# EAGLE design MegaAndLed (EAGLE 6.1)
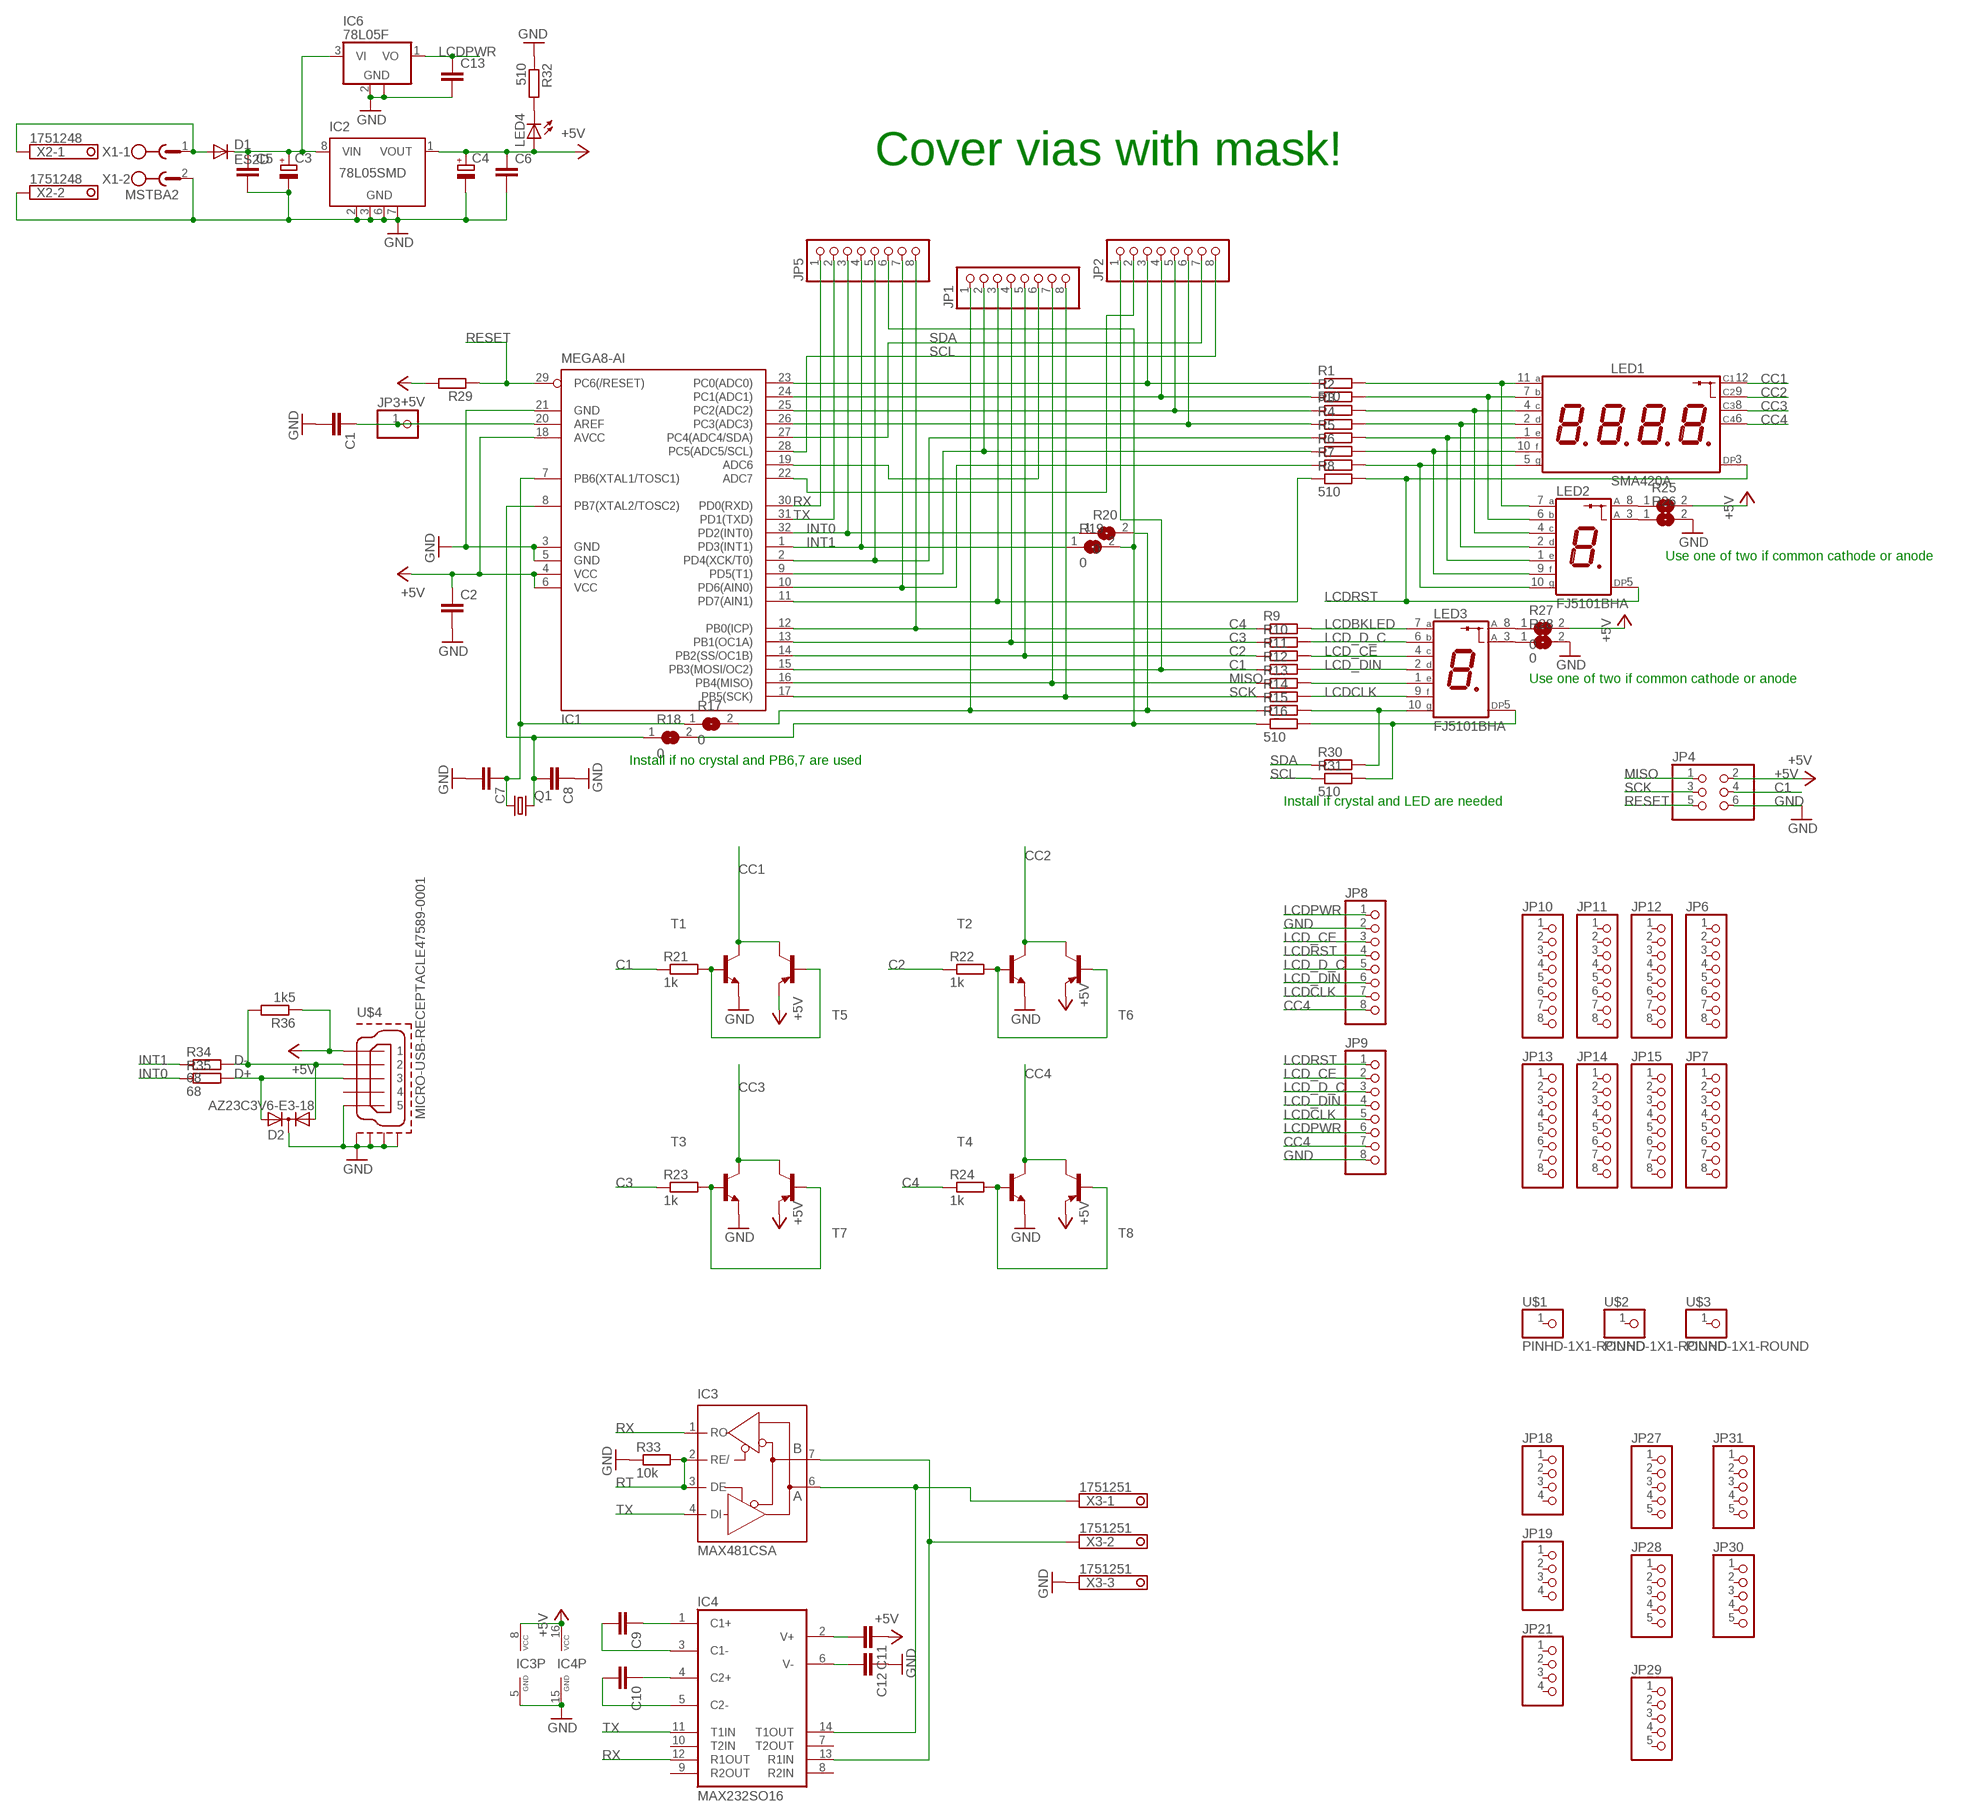
[diagram p0: schematic, sheet 1]

## Parts
C1  C-EUC0805  [C0805]
C2  C-EUC0805  [C0805]
C3  CPOL-EUSMCC  [SMC_C]
C4  CPOL-EUSMCC  [SMC_C]
C5  C-EUC0805  [C0805]
C6  C-EUC0805  [C0805]
C7  C-EUC0805  [C0805]
C8  C-EUC0805  [C0805]
C9  C-EUC0805  [C0805]
C10  C-EUC0805  [C0805]
C11  C-EUC0805  [C0805]
C12  C-EUC0805  [C0805]
C13  C-EUC0805  [C0805]
D1  ES2D  [SMB]
D2  AZ23C3V6-E3-18  DIODE-2AC|CASOT23  [SOT23]
IC1  MEGA8-AI  [TQFP32-08]
IC2  78L05SMD  [SO08]
IC3  MAX481CSA  [SO08]
IC4  MAX232SO16  [SO16]
IC6  78L05F  [SOT89]
JP1  PINHD-1X8-ROUND  [1X08-ROUND]
JP2  PINHD-1X8-ROUND  [1X08-ROUND]
JP3  PINHD-1X1  [1X01]
JP4  PINHD-2X3  [2X03]
JP5  PINHD-1X8-ROUND  [1X08-ROUND]
JP6  PINHD-1X8-ROUND  [1X08-ROUND]
JP7  PINHD-1X8-ROUND  [1X08-ROUND]
JP8  PINHD-1X8-ROUND  [1X08-ROUND]
JP9  PINHD-1X8-ROUND  [1X08-ROUND]
JP10  PINHD-1X8-ROUND  [1X08-ROUND]
JP11  PINHD-1X8-ROUND  [1X08-ROUND]
JP12  PINHD-1X8-ROUND  [1X08-ROUND]
JP13  PINHD-1X8-ROUND  [1X08-ROUND]
JP14  PINHD-1X8-ROUND  [1X08-ROUND]
JP15  PINHD-1X8-ROUND  [1X08-ROUND]
JP18  PINHD-1X4-ROUND  [1X04-ROUND]
JP19  PINHD-1X4-ROUND  [1X04-ROUND]
JP21  PINHD-1X4-ROUND  [1X04-ROUND]
JP27  PINHD-1X5-ROUND  [1X05-ROUND]
JP28  PINHD-1X5-ROUND  [1X05-ROUND]
JP29  PINHD-1X5-ROUND  [1X05-ROUND]
JP30  PINHD-1X5-ROUND  [1X05-ROUND]
JP31  PINHD-1X5-ROUND  [1X05-ROUND]
LED1  SMA420A  [7X4-LED]
LED2  FJ5101BHA  [LA-401]
LED3  FJ5101BHA  [LA-401]
LED4  LEDCHIPLED_1206  [CHIPLED_1206]
Q1  CRYSTALHC49U-H  [HC49U-H]
R1  510  R-EU_R0805  [R0805]
R2  R-EU_R0805  [R0805]
R3  R-EU_R0805  [R0805]
R4  R-EU_R0805  [R0805]
R5  R-EU_R0805  [R0805]
R6  R-EU_R0805  [R0805]
R7  R-EU_R0805  [R0805]
R8  510  R-EU_R0805  [R0805]
R9  R-EU_R0805  [R0805]
R10  R-EU_R0805  [R0805]
R11  R-EU_R0805  [R0805]
R12  R-EU_R0805  [R0805]
R13  R-EU_R0805  [R0805]
R14  R-EU_R0805  [R0805]
R15  R-EU_R0805  [R0805]
R16  510  R-EU_R0805  [R0805]
R17  0  SJ  [SJ]
R18  0  SJ  [SJ]
R19  0  SJ  [SJ]
R20  0  SJ  [SJ]
R21  1k  R-EU_R0805  [R0805]
R22  1k  R-EU_R0805  [R0805]
R23  1k  R-EU_R0805  [R0805]
R24  1k  R-EU_R0805  [R0805]
R25  SJ  [SJ]
R26  SJ  [SJ]
R27  0  SJ  [SJ]
R28  0  SJ  [SJ]
R29  R-EU_R0805  [R0805]
R30  R-EU_R0805  [R0805]
R31  510  R-EU_R0805  [R0805]
R32  510  R-EU_R0805  [R0805]
R33  10k  R-EU_R0805  [R0805]
R34  68  R-EU_R0805  [R0805]
R35  68  R-EU_R0805  [R0805]
R36  1k5  R-EU_R0805  [R0805]
T1  BCW31-NPN-SOT23-BEC  [SOT23-BEC]
T2  BCW31-NPN-SOT23-BEC  [SOT23-BEC]
T3  BCW31-NPN-SOT23-BEC  [SOT23-BEC]
T4  BCW31-NPN-SOT23-BEC  [SOT23-BEC]
T5  MMBTA56-SOT23  [SOT23]
T6  MMBTA56-SOT23  [SOT23]
T7  MMBTA56-SOT23  [SOT23]
T8  MMBTA56-SOT23  [SOT23]
U$1  PINHD-1X1-ROUND  [1X01-ROUND]
U$2  PINHD-1X1-ROUND  [1X01-ROUND]
U$3  PINHD-1X1-ROUND  [1X01-ROUND]
U$4  MICRO-USB-RECEPTACLE47589-0001  [47589-0001]
X1  MSTBA2  [MSTBA2]
X2  1751248  [1751248]
X3  1751251  [1751251]

## Nets
+5V: C2.1 C4.+ C6.1 C11.1 IC1.4(VCC) IC1.6(VCC) IC1.18(AVCC) IC2.1(VOUT) IC3.8(VCC) IC4.16(VCC) JP4.2 LED4.A R25.2 R27.2 R29.2 R36.1 T5.2(E) T6.2(E) T7.2(E) T8.2(E) U$4.1
C1: IC1.15(PB3(MOSI/OC2)) JP2.1 JP4.4 R12.1 R21.1
C2: IC1.14(PB2(SS/OC1B)) JP1.5 R11.1 R22.1
C3: IC1.13(PB1(OC1A)) JP1.4 R10.1 R23.1
C4: IC1.12(PB0(ICP)) JP5.8 R9.1 R24.1
CC1: LED1.12(C) T1.C T5.3(C)
CC2: LED1.9(C) T2.C T6.3(C)
CC3: LED1.8(C) T3.C T7.3(C)
CC4: JP8.8 JP9.7 LED1.6(C) T4.C T8.3(C)
D+: D2.2(A2) R35.2 U$4.3
D-: D2.1(A1) R34.2 R36.2 U$4.2
GND: C1.2 C2.2 C3.- C4.- C5.2 C6.2 C7.2 C8.1 C12.1 C13.2 D2.3(C) IC1.3(GND) IC1.5(GND) IC1.21(GND) IC2.2(GND) IC2.3(GND) IC2.6(GND) IC2.7(GND) IC3.5(GND) IC4.15(GND) IC6.2(GND) IC6.2@1(GND) JP4.6 JP8.2 JP9.8 R26.2 R28.2 R32.1 R33.1 T1.E T2.E T3.E T4.E U$4.5 U$4.CASING1(GND1) U$4.CASING2(GND2) U$4.CASING3(GND3) U$4.CASING4(GND4) X1.2 X2.2 X3.3
INT0: IC1.32(PD2(INT0)) JP5.3 R20.1 R35.1
INT1: IC1.1(PD3(INT1)) JP5.4 R19.1 R34.1
LCD_CE: JP8.3 JP9.2 LED3.4(C) R11.2
LCD_D_C: JP8.5 JP9.3 LED3.6(B) R10.2
LCD_DIN: JP8.6 JP9.4 LED3.2(D) R12.2
LCDBKLED: LED3.7(A) R9.2
LCDCLK: JP8.7 JP9.5 LED3.9(F) R14.2
LCDPWR: C13.1 IC6.1(VO) JP8.1 JP9.6
LCDRST: JP8.4 JP9.1 LED1.3(DP) LED2.5(DP) R8.2
MISO: IC1.16(PB4(MISO)) JP1.7 JP4.1 R13.1
N$1: C3.+ C5.1 D1.C IC2.8(VIN) IC6.3(VI)
N$2: IC1.23(PC0(ADC0)) JP2.3 R1.1
N$3: IC1.24(PC1(ADC1)) JP2.4 R2.1
N$4: IC1.25(PC2(ADC2)) JP2.5 R3.1
N$5: R21.2 T1.B T5.1(B)
N$6: R22.2 T2.B T6.1(B)
N$7: IC1.26(PC3(ADC3)) JP2.6 R4.1
N$8: C1.1 IC1.20(AREF) JP3.1
N$9: LED2.8(C) R25.1
N$10: LED2.3(C) R26.1
N$11: LED3.8(C) R27.1
N$12: LED3.3(C) R28.1
N$13: IC1.19(ADC6) JP1.6
N$14: IC1.2(PD4(XCK/T0)) JP5.5 R5.1
N$15: R23.2 T3.B T7.1(B)
N$16: R24.2 T4.B T8.1(B)
N$17: IC1.22(ADC7) JP2.2
N$19: IC1.9(PD5(T1)) JP1.2 R6.1
N$20: IC1.10(PD6(AIN0)) JP5.7 R7.1
N$22: LED4.C R32.2
N$23: C9.1 IC4.1(C1+)
N$24: D1.A X1.1 X2.1
N$25: C10.1 IC4.4(C2+)
N$29: IC1.11(PD7(AIN1)) JP1.3 R8.1
N$30: C8.2 IC1.8(PB7(XTAL2/TOSC2)) Q1.2 R18.1
N$31: C10.2 IC4.5(C2-)
N$32: C9.2 IC4.3(C1-)
N$35: C11.2 IC4.2(V+)
N$36: JP5.6 R16.1 R18.2 R19.2
N$37: LED1.11(A) LED2.7(A) R1.2
N$38: LED1.7(B) LED2.6(B) R2.2
N$39: LED1.4(C) LED2.4(C) R3.2
N$40: LED1.2(D) LED2.2(D) R4.2
N$41: LED1.1(E) LED2.1(E) R5.2
N$42: LED1.10(F) LED2.9(F) R6.2
N$43: LED1.5(G) LED2.10(G) R7.2
N$50: LED3.1(E) R13.2
N$52: LED3.10(G) R15.2 R30.2
N$53: LED3.5(DP) R16.2 R31.2
N$68: C12.2 IC4.6(V-)
N$69: JP1.1 R15.1 R17.2 R20.2
N$70: IC3.6(A) IC4.14(T1OUT) X3.1
N$71: IC3.7(B) IC4.13(R1IN) X3.2
N$72: C7.1 IC1.7(PB6(XTAL1/TOSC1)) Q1.1 R17.1
RESET: IC1.29(PC6(/RESET)) JP4.5 R29.1
RT: IC3.2(RE/) IC3.3(DE) R33.2
RX: IC1.30(PD0(RXD)) IC3.1(RO) IC4.12(R1OUT) JP5.1
SCK: IC1.17(PB5(SCK)) JP1.8 JP4.3 R14.1
SCL: IC1.28(PC5(ADC5/SCL)) JP2.8 R31.1
SDA: IC1.27(PC4(ADC4/SDA)) JP2.7 R30.1
TX: IC1.31(PD1(TXD)) IC3.4(DI) IC4.11(T1IN) JP5.2
Unconnected: IC2.4(NC) IC2.5(NC) IC4.7(T2OUT) IC4.8(R2IN) IC4.9(R2OUT) IC4.10(T2IN) JP6.1 JP6.2 JP6.3 JP6.4 JP6.5 JP6.6 JP6.7 JP6.8 JP7.1 JP7.2 JP7.3 JP7.4 JP7.5 JP7.6 JP7.7 JP7.8 JP10.1 JP10.2 JP10.3 JP10.4 JP10.5 JP10.6 JP10.7 JP10.8 JP11.1 JP11.2 JP11.3 JP11.4 JP11.5 JP11.6 JP11.7 JP11.8 JP12.1 JP12.2 JP12.3 JP12.4 JP12.5 JP12.6 JP12.7 JP12.8 JP13.1 JP13.2 JP13.3 JP13.4 JP13.5 JP13.6 JP13.7 JP13.8 JP14.1 JP14.2 JP14.3 JP14.4 JP14.5 JP14.6 JP14.7 JP14.8 JP15.1 JP15.2 JP15.3 JP15.4 JP15.5 JP15.6 JP15.7 JP15.8 JP18.1 JP18.2 JP18.3 JP18.4 JP19.1 JP19.2 JP19.3 JP19.4 JP21.1 JP21.2 JP21.3 JP21.4 JP27.1 JP27.2 JP27.3 JP27.4 JP27.5 JP28.1 JP28.2 JP28.3 JP28.4 JP28.5 JP29.1 JP29.2 JP29.3 JP29.4 JP29.5 JP30.1 JP30.2 JP30.3 JP30.4 JP30.5 JP31.1 JP31.2 JP31.3 JP31.4 JP31.5 U$1.1 U$2.1 U$3.1 U$4.4

## Notes on the sheet
- Cover vias with mask!
- Use one of two if common cathode or anode
- Use one of two if common cathode or anode
- Install if no crystal and PB6,7 are used
- Install if crystal and LED are needed

## Library data of the parts
C1 C2 C5-C13 = rcl:C-EU: CAPACITOR, European symbol
C3 C4 = rcl:CPOL-EU: POLARIZED CAPACITOR, European symbol
D1 = diode:ES2D: DIODE super fast rectifier, 2 A
D2 = diode:DIODE-2AC|CA: Dual DIODE Anode-Cathode|Cathode-Anode
IC1 = atmel:MEGA8: MICROCONTROLLER 8 Kbytes FLASH, 1 kbytes SRAM, 512 bytes EEPROM, USART, 6-channel 10 bit ADC, 2-channel 8 bit ADC Pin compatible with Atmega48, ATMega88, ATMega168 Source: avr.lbr
IC2 = linear:78L*SMD: Positive VOLTAGE REGULATOR
IC3 = maxim:MAX481CSA: RS485 TRANSEIVER
IC4 = MAX232:MAX232: RS232 TRANSEIVER
IC6 = linear:78L*: POSITOIV-VOLTAGE REGULATORS Output up to 100 mA Source: http://focus.ti.com/lit/ds/symlink/ua78l05.pdf
JP1 JP2 JP5-JP15 = Pinhead1x8round:PINHD-1X8-ROUND: PIN HEADER
JP3 = pinhead:PINHD-1X1: PIN HEADER
JP4 = pinhead:PINHD-2X3: PIN HEADER
JP18 JP19 JP21 = Pinhead1x8round:PINHD-1X4-ROUND: PIN HEADER
JP27-JP31 = Pinhead1x8round:PINHD-1X5-ROUND: PIN HEADER
LED1 = SMA420:SMA420: 4 Digit LED Numeric Display (cathode common) SMA420* China 20*51mm h
LED2 LED3 = FJ5101BH:FJ5101BH: Single Digit LED Numeric Display (anode common) FJ5101BH China 20*12.8mm
LED4 = led:LED: LED OSRAM: - CHIPLED LG R971, LG N971, LY N971, LG Q971, LY Q971, LO R971, LY R971 LH N974, LH R974 LS Q976, LO Q976, LY Q976 LO Q996 - Hyper CHIPLED LW Q18S LB Q993, LB Q99A, LB R99A - SideLED LS A670, LO A670, LY A670, LG A670, LP A670 LB A673, LV A673, LT A673, LW A673 LH A674 LY A675 LS A676, LA A676, LO A676, LY A676, LW A676 LS A679, LY A679, LG A679 - Hyper Micro SIDELED® LS Y876, LA Y876, LO Y876, LY Y876 LT Y87S - SmartLED LW L88C, LW L88S LB L89C, LB L89S, LG L890 LS L89K, LO L89K, LY L89K LS L896, LA L896, LO L896, LY L896 - TOPLED LS T670, LO T670, LY T670, LG T670, LP T670 LSG T670, LSP T670, LSY T670, LOP T670, LYG T670 LG T671, LOG T671, LSG T671 LB T673, LV T673, LT T673, LW T673 LH T674 LS T676, LA T676, LO T676, LY T676, LB T676, LH T676, LSB T676, LW T676 LB T67C, LV T67C, LT T67C, LS T67K, LO T67K, LY T67K, LW E67C LS E67B, LA E67B, LO E67B, LY E67B, LB E67C, LV E67C, LT E67C LW T67C LS T679, LY T679, LG T679 LS T770, LO T770, LY T770, LG T770, LP T770 LB T773, LV T773, LT T773, LW T773 LH T774 LS E675, LA E675, LY E675, LS T675 LS T776, LA T776, LO T776, LY T776, LB T776 LHGB T686 LT T68C, LB T68C - Hyper Mini TOPLED® LB M676 - Mini TOPLED Santana® LG M470 LS M47K, LO M47K, LY M47K Source: http://www.osram.convergy.de LUXEON: - LUMILED® LXK2-PW12-R00, LXK2-PW12-S00, LXK2-PW14-U00, LXK2-PW14-V00 LXK2-PM12-R00, LXK2-PM12-S00, LXK2-PM14-U00 LXK2-PE12-Q00, LXK2-PE12-R00, LXK2-PE12-S00, LXK2-PE14-T00, LXK2-PE14-U00 LXK2-PB12-K00, LXK2-PB12-L00, LXK2-PB12-M00, LXK2-PB14-N00, LXK2-PB14-P00, LXK2-PB14-Q00 LXK2-PR12-L00, LXK2-PR12-M00, LXK2-PR14-Q00, LXK2-PR14-R00 LXK2-PD12-Q00, LXK2-PD12-R00, LXK2-PD12-S00 LXK2-PH12-R00, LXK2-PH12-S00 LXK2-PL12-P00, LXK2-PL12-Q00, LXK2-PL12-R00 Source: www.luxeon.com KINGBRIGHT: KA-3528ASYC Source: www.kingbright.com
Q1 = crystal:CRYSTAL: CRYSTAL
R1-R16 R21-R24 R29-R36 = rcl:R-EU_: RESISTOR, European symbol
R17-R20 R25-R28 = jumper:SJ: SMD solder JUMPER
T1-T4 = transistor:*-NPN-: NPN Transistror
T5-T8 = transistor-pnp:*-?: PNP Transistor
U$1-U$3 = Pinhead1x8round:PINHD-1X1-ROUND
U$4 = con-molex-usb:MICRO-USB-RECEPTACLE: MICRO USB RECEPTACLES Micro-USB Receptacles, SMT, Lead-Free from MOLEX <http://www.molex.com/>. (C) 2014 Tomasz Boleslaw CEDRO, cederom@tlen.pl, http://www.tomek.cedro.info. Version 0.1 (2014-01-17): Initial release. Version 0.2 (2014-02-06): Updated 47589-0001 footprint pins/pads/milling. Following devices are included: 1. 47589-0001 Micro-USB AB Receptacle, Bottom Mount, SMT, Lead-Free <http://www.molex.com/molex/products/datasheet.jsp?part=active/0475890001_IO_CONNECTORS.xml> (Technical Drawing <http://www.molex.com/pdm_docs/sd/475890001_sd.pdf>).
X1 = con-phoenix-508:MSTBA2: PHOENIX
X2 = con-phoenix-350:1751248: MKDS 1/ 2-3,5 Printklemme Nennstrom: 10 A Bemessungsspannung: 160 V Raster: 3,5 mm Polzahl: 2 Montageart: Löten Anschlussart: Schraubanschluss Anschlussrichtung vom Leiter zur Platine: 0° Source: http://eshop.phoenixcontact.com .. 1751248.pdf
X3 = con-phoenix-350:1751251: MKDS 1/ 3-3,5 Printklemme Nennstrom: 10 A Bemessungsspannung: 160 V Raster: 3,5 mm Polzahl: 3 Montageart: Löten Anschlussart: Schraubanschluss Anschlussrichtung vom Leiter zur Platine: 0° Source: http://eshop.phoenixcontact.com .. 1751251.pdf

## Board
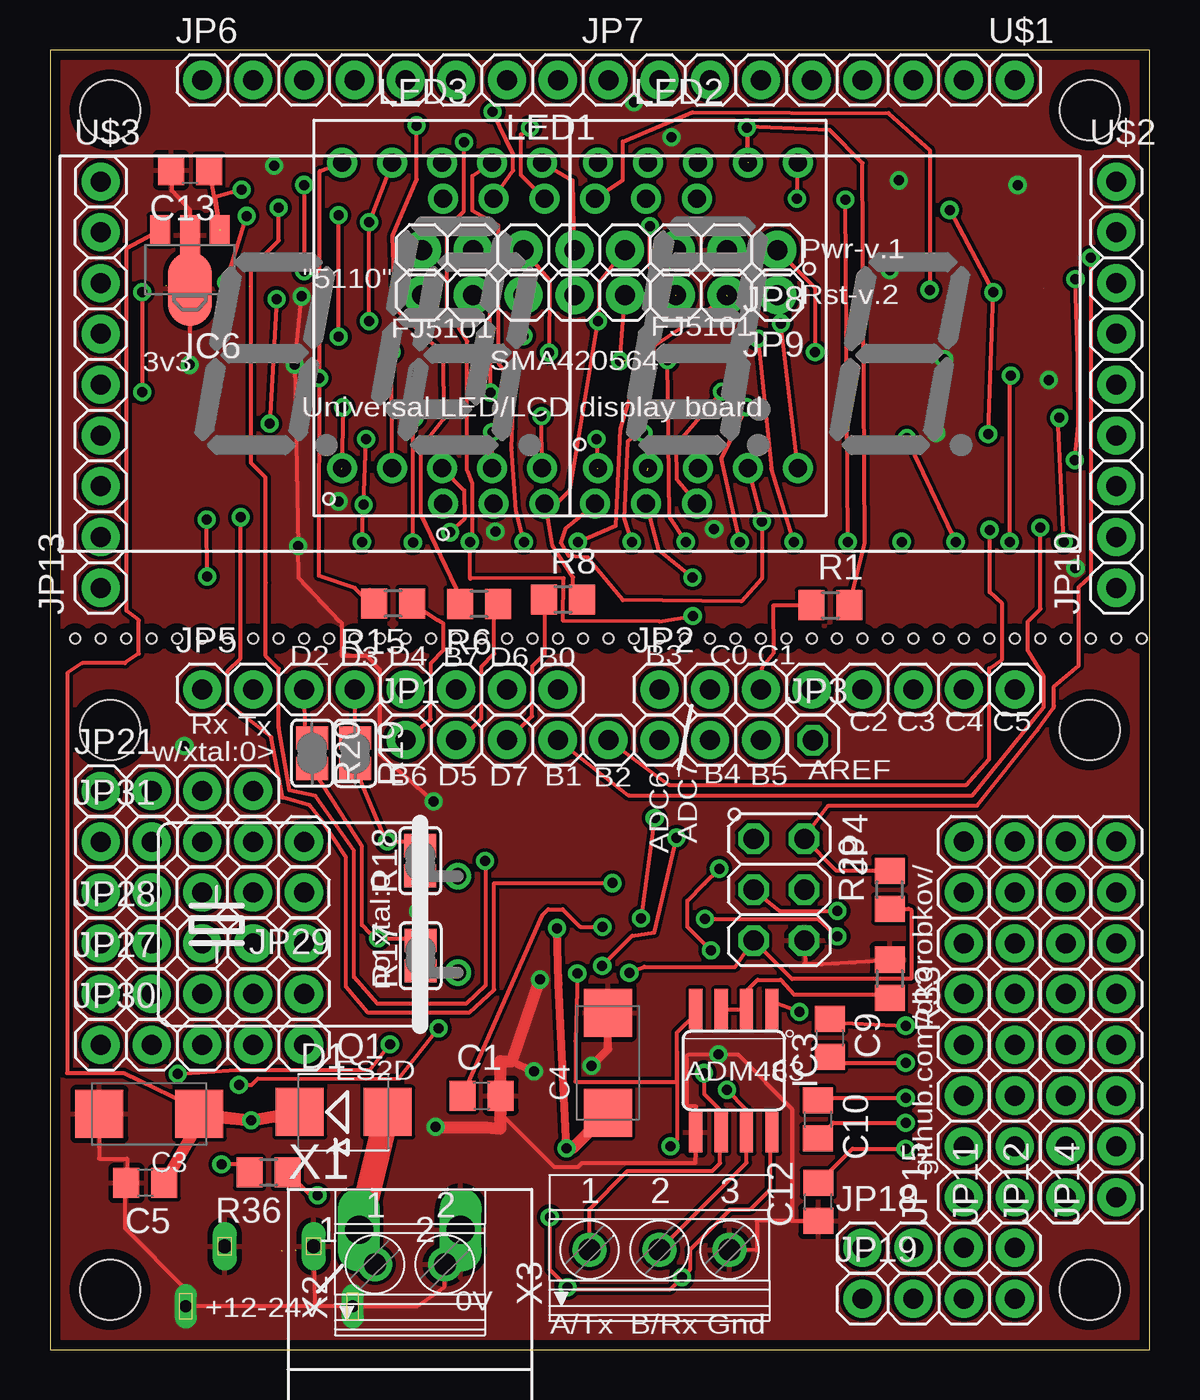
[diagram p1: board, top side]
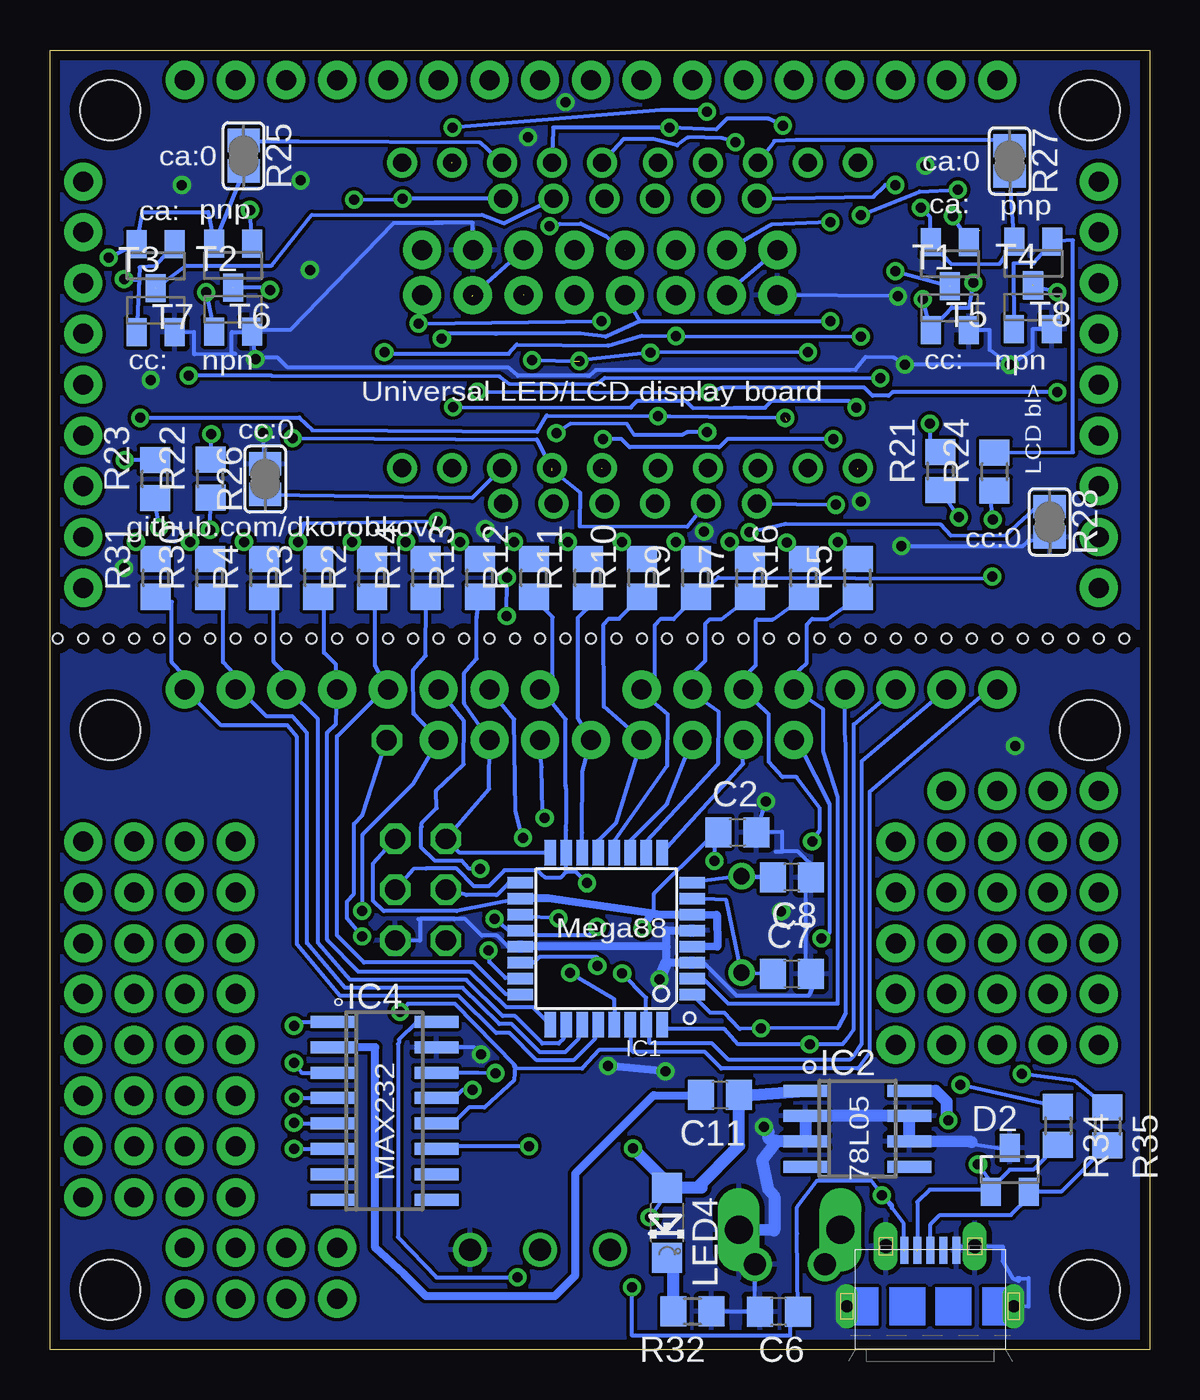
[diagram p2: board, bottom side, seen from below]

Size 55 x 65 mm. Coordinates in mm from the lower left corner, seen from the top.
Outline: 0,0 55,0 55,65 0,65 0,0
Copper layers (1*16): Top 0.0356mm / dielectric 1.5011mm / Bottom 0.0356mm
Design rules: minimum track width 7mil, minimum drill 0.5mm, track to track 7mil, track to pad 7mil, pad to pad 7mil, via to via 7mil, smd to smd 7mil, copper to edge 0.5004mm, drill to drill 0.2489mm, minimum pad ring 10mil, minimum via ring 8mil, stop-mask expansion 4mil, vias tented up to drill 0.5994mm, thermal gap 10mil
Holes 3 mm at 3,3 52,3 52,62 3,62 52,31 3,31
Holes 0.5 mm at 1.27,35.56 2.54,35.56 3.81,35.56 5.08,35.56 6.35,35.56 7.62,35.56 8.89,35.56 10.16,35.56 11.43,35.56 12.7,35.56 13.97,35.56 15.24,35.56 16.51,35.56 17.78,35.56 19.05,35.56 20.32,35.56 21.59,35.56 22.86,35.56 24.13,35.56 25.4,35.56 26.67,35.56 27.94,35.56 29.21,35.56 30.48,35.56 31.75,35.56 33.02,35.56 34.29,35.56 35.56,35.56 36.83,35.56 38.1,35.56 39.37,35.56 40.64,35.56 41.91,35.56 43.18,35.56 44.45,35.56 45.72,35.56 46.99,35.56 48.26,35.56 49.53,35.56 50.8,35.56 52.07,35.56 53.34,35.56 54.61,35.56

### Footprints (pad centres in the part's own frame; a part is rotated, then mirrored left to right if it is on the bottom)
C0805 = smd 1.3 x 1.5: 1 -0.95,0; 2 0.95,0
SMC_C = smd 2.4 x 2.4: + -2.5,0; - 2.5,0
SMB = smd 2.4 x 2.4: A 2.2,0; C -2.2,0
SOT23 = smd 1 x 1.4: 1 -0.95,-1.1; 2 0.95,-1.1; 3 0,1.1
TQFP32-08 = smd 1.27 x 0.559: 1 -4.293,2.8; 2 -4.293,2; 3 -4.293,1.2; 4 -4.293,0.4; 5 -4.293,-0.4; 6 -4.293,-1.2; 7 -4.293,-2; 8 -4.293,-2.8; 17 4.293,-2.8; 18 4.293,-2; 19 4.293,-1.2; 20 4.293,-0.4; 21 4.293,0.4; 22 4.293,1.2; 23 4.293,2; 24 4.293,2.8 | smd 0.559 x 1.27: 9 -2.8,-4.293; 10 -2,-4.293; 11 -1.2,-4.293; 12 -0.4,-4.293; 13 0.4,-4.293; 14 1.2,-4.293; 15 2,-4.293; 16 2.8,-4.293; 25 2.8,4.293; 26 2,4.293; 27 1.2,4.293; 28 0.4,4.293; 29 -0.4,4.293; 30 -1.2,4.293; 31 -2,4.293; 32 -2.8,4.293
SO08 = smd 0.6 x 2.2: 1 -1.905,-2.6; 2 -0.635,-2.6; 3 0.635,-2.6; 4 1.905,-2.6; 5 1.905,2.6; 6 0.635,2.6; 7 -0.635,2.6; 8 -1.905,2.6
SO08' = smd 0.66 x 2.032: 1 -1.905,-3.073; 2 -0.635,-3.073; 3 0.635,-3.073; 4 1.905,-3.073; 5 1.905,3.073; 6 0.635,3.073; 7 -0.635,3.073; 8 -1.905,3.073
SO16 = smd 0.6 x 2.2: 1 -4.445,-2.6; 2 -3.175,-2.6; 3 -1.905,-2.6; 4 -0.635,-2.6; 5 0.635,-2.6; 6 1.905,-2.6; 7 3.175,-2.6; 8 4.445,-2.6; 9 4.445,2.6; 10 3.175,2.6; 11 1.905,2.6; 12 0.635,2.6; 13 -0.635,2.6; 14 -1.905,2.6; 15 -3.175,2.6; 16 -4.445,2.6
SOT89 = smd 1 x 1.5: 1 -1.499,-1.981; 3 1.499,-1.981 | smd 1 x 2: 2 0,-1.727 | smd 2.2 x 3.7: 2@1 0,0.94
1X08-ROUND = drill 1 pad 1.905: 1 -8.89,0; 2 -6.35,0; 3 -3.81,0; 4 -1.27,0; 5 1.27,0; 6 3.81,0; 7 6.35,0; 8 8.89,0
1X01 = drill 1.016 octagon: 1 0,0
2X03 = drill 1.016 octagon: 1 -2.54,-1.27; 2 -2.54,1.27; 3 0,-1.27; 4 0,1.27; 5 2.54,-1.27; 6 2.54,1.27
1X04-ROUND = drill 1 pad 1.905: 1 -3.81,0; 2 -1.27,0; 3 1.27,0; 4 3.81,0
1X05-ROUND = drill 1 pad 1.905: 1 -5.08,0; 2 -2.54,0; 3 0,0; 4 2.54,0; 5 5.08,0
7X4-LED = drill 0.9 pad 1.5: 1 -6.35,-7.5; 2 -3.81,-7.5; 3 -1.27,-7.5; 4 1.27,-7.5; 5 3.81,-7.5; 6 6.35,-7.49; 7 6.35,7.75; 8 3.81,7.75; 9 1.27,7.75; 10 -1.27,7.75; 11 -3.81,7.75; 12 -6.35,7.75
LA-401 = drill 0.9 pad 1.5: 1 -5,-7.5; 2 -2.5,-7.5; 3 0,-7.5; 4 2.5,-7.5; 5 5,-7.5; 6 5,7.75; 7 2.5,7.75; 8 0,7.75; 9 -2.5,7.75; 10 -5,7.75
CHIPLED_1206 = smd 1.5 x 1.5: A 0,-1.75; C 0,1.75
HC49U-H = drill 0.813: 1 -2.413,-5.08; 2 2.413,-5.08
R0805 = smd 1.3 x 1.5: 1 -0.95,0; 2 0.95,0
SJ = smd 1.168 x 1.6: 1 -0.762,0; 2 0.762,0
SOT23-BEC = smd 1 x 1.4: B -0.95,-1.1; C 0,1.1; E 0.95,-1.1
1X01-ROUND = drill 1 pad 1.905: 1 0,0
47589-0001 = smd 1.35 x 0.4: 1 2.8,1.3; 2 2.8,0.65; 3 2.8,0; 4 2.8,-0.65; 5 2.8,-1.3 | drill 0.6 pad 0.95 long: CASING1 0,4.175; CASING2 0,-4.175 | drill 0.7 pad 1.1 long: CASING3 3,2.225; CASING4 3,-2.225
MSTBA2 = drill 1.397 long: 1 -2.54,5.08; 2 2.54,5.08
1751248 = drill 1.1 pad 1.7: 1 -1.75,-0.1; 2 1.75,-0.1
1751251 = drill 1.1 pad 1.7: 1 -3.5,-0.1; 2 0,-0.1; 3 3.5,-0.1

### Placement (x,y rotation side)
C1  21.59,12.7 0 top
C2  20.62,25.88 0 bottom
C3  4.97,11.79 180 top
C4  27.91,14.35 90 top
C5  4.77,8.34 180 top
C6  18.55,1.9 180 bottom
C7  17.9,18.8 0 bottom
C8  17.9,23.62 180 bottom
C9  39,15.59 270 top
C10  38.4,11.51 270 top
C11  21.48,12.73 180 bottom
C12  38.43,7.39 90 top
C13  7,59 180 top
D1  14.69,11.88 0 top
D2  7,9 0 bottom
IC1  27.18,20.55 180 bottom
IC2  14.61,11.04 270 bottom
IC3  MAX481CSA  [SO08']  34.21,13.95 180 top
IC4  38.27,11.95 270 bottom
IC6  7,54 180 top
JP1  26.67,30.48 0 top
JP2  39.37,33.02 0 top
JP3  38.16,30.47 0 top
JP4  36.47,23 270 top
JP5  16.51,33.02 0 top
JP6  16.51,63.5 0 top
JP7  36.83,63.5 0 top
JP8  27.5,55 180 top
JP9  27.5,52.74 180 top
JP10  53.34,46.99 90 top
JP11  48.26,16.51 90 top
JP12  50.8,16.51 90 top
JP13  2.54,46.99 90 top
JP14  53.34,16.51 90 top
JP15  45.72,16.51 90 top
JP18  44.45,5.08 0 top
JP19  44.45,2.54 0 top
JP21  6.35,27.94 0 top
JP27  7.62,17.78 0 top
JP28  7.62,20.32 0 top
JP29  7.62,22.86 180 top
JP30  7.62,15.24 0 top
JP31  7.62,25.4 0 top
LED1  26,49.81 0 top
LED2  32.4,51.6 0 top
LED3  19.6,51.6 0 top
LED4  24.13,6.35 180 bottom
Q1  15.33,21.27 90 top
R1  39.03,37.23 0 top
R2  38.9,38.6 90 bottom
R3  41.6,38.6 90 bottom
R4  44.3,38.6 90 bottom
R5  14.6,38.6 90 bottom
R6  21.45,37.29 180 top
R7  20,38.6 90 bottom
R8  25.67,37.52 0 top
R9  22.7,38.6 90 bottom
R10  25.4,38.6 90 bottom
R11  28.1,38.6 90 bottom
R12  30.8,38.6 90 bottom
R13  33.5,38.6 90 bottom
R14  36.2,38.6 90 bottom
R15  17.15,37.31 180 top
R16  17.3,38.6 90 bottom
R17  18.54,19.7 90 top
R18  18.52,24.45 90 top
R19  15.26,29.82 270 top
R20  13.11,29.83 270 top
R21  10.45,43.93 90 bottom
R22  46.97,43.55 90 bottom
R23  49.75,43.55 90 bottom
R24  7.75,43.92 90 bottom
R25  45.32,59.71 270 bottom
R26  44.23,43.53 90 bottom
R27  7,59.45 270 bottom
R28  5,41.4 270 bottom
R29  42,23 90 top
R30  47,38.6 90 bottom
R31  49.7,38.6 90 bottom
R32  22.86,1.91 180 bottom
R33  42,18.55 270 top
R34  4.58,11.18 270 bottom
R35  2.11,11.16 270 bottom
R36  10.94,8.86 180 top
T1  10,52.1 0 bottom
T2  45.84,52.01 0 bottom
T3  49.71,51.98 0 bottom
T4  5.83,52.14 0 bottom
T5  9.99,54.29 180 bottom
T6  45.85,54.22 180 bottom
T7  49.71,54.19 180 bottom
T8  5.81,54.32 180 bottom
U$1  48.26,63.5 0 top
U$2  53.34,58.42 0 top
U$3  2.54,58.42 0 top
U$4  10.97,2.16 90 bottom
X1  18,0.91 0 top
X2  18,4.37 0 top
X3  30.48,5.08 0 top

### Tracks (layer width: path | path; a pad name or v marks a point on that pad's centre or on a via)
+5V  (via drill 0.5)  (1 unrouted)
  Top 0.2: v21.77,24.43 21.79,24.39 21.79,18.22 20.8,17.3 16.38,17.3 15.2,18.63 15.2,24.96 13.28,27.7 11.98,27.97 11.44,31.13 11.44,34.04 10.79,34.68 10.79,38.34 10.78,38.36 10.78,43.62 10.05,44.35 10.05,54.08 11.45,55.48 v11.45,57.11 | R29.2 39.34,23.95 JP4.2 37.75,25.75 38,26 | 38,26 38,25.8 JP4.2 | 38,26 38.95,27.2 46.38,27.2 49.4,31.01 50.21,32.11 50.22,32.21 50.21,33.17 51.46,34.2 51.46,38.13 52.05,38.68 v52.06,54.61 | IC3.8 36,10.76 36,8 35,7 34,7 32,5 32,4 31.5,3.5 v31.6,3.6 31,3 26,3 | 26,3 v25.88,3.12 | v25.88,3.12 25,4 v25,6.62 | v25.88,3.12 26,3.12 26,3 | R36.1 13.04,7.71 v13.38,7.71
  Top 0.406: v25.36,21.07 25.45,18.3 v25.83,10.07
  Top 0.61: v25.83,10.07 26.13,10.07 C4.+
  Bottom 0.2: IC1.18 34.64,21.93 38.31,21.93 38.84,22.45 38.84,24.31 JP4.2 | 24.78,21.79 24.78,22.8 22.17,25.41 22.03,25.41 C2.1 21.77,25.67 v21.77,24.43 | T5.2 10.8,55.24 | 10.8,55.24 9.92,54.29 7.5,54.3 T8.2 R27.2 | R25.2 T6.2 47.08,56.89 50.35,56.89 T7.2 v52.06,54.61 | v11.45,57.11 11,56.66 11,55 10.8,55.2 10.8,55.24 | v25,6.62 24,8 24,8.1 | IC4.16 35.71,16.35 36.69,16.35 37.54,15.5 37.54,15.33 37.59,15.28 37.59,5.62 35.67,3.6 v31.6,3.6 | v25.88,3.12 25.88,0.7 17.98,0.7 17.98,1.9 C6.1 17.64,5.8 17.64,7.12 16.61,8.45 13.95,8.45 v13.38,7.71 | v13.38,7.71 12.9,7.08 | 12.9,7.08 12.3,6.3 12.3,4.94 | v13.38,7.71 12.9,7.23 12.9,7.08
  Bottom 0.406: IC1.18 30.07,22.57 24.89,21.8 | 24.89,21.8 24.78,21.79 24.66,21.77 IC1.6 21.64,21.75 21.62,20.14 IC1.4 | v25.36,21.07 24.89,21.8
  Bottom 0.61: 22.39,8.1 22.62,8.1 | 22.62,8.1 24,8.1 LED4.A 24.13,8.37 v25.83,10.07 | IC2.1 20.5,12.7 C11.1 20.53,10.19 22.62,8.1
C1  (via drill 0.5)
  Top 0.2: v28.13,23.33 22.22,23.33 22.22,17.99 20.99,16.87 15.88,16.87 14.8,18.14 14.8,24.62 13.57,26.5 13,27.21 11.63,27.61 11.06,30.63 8.89,32.3 8.89,33.94 9.53,34.57 9.53,37.54 v9.54,41.63
  Bottom 0.2: 29.18,23.88 IC1.15 29.18,25.99 29.17,26.54 29.17,27.98 29.21,28.23 29.21,31.51 30.46,33.05 JP2.1 29.86,33.68 29.86,36.63 30.41,37.18 R12.1 | 29.18,23.88 29.46,23.59 30.21,23.59 30.63,23.97 32.26,23.97 33.06,23.18 33.8,23.18 34.66,24.06 36.2,24.06 36.82,24.03 JP4.4 | v28.13,23.33 28.68,23.88 29.18,23.88 | v9.54,41.63 R21.1
C2  (via drill 0.5)
  Top 0.2: JP1.5 30.97,28.24 45.83,28.24 46.98,29.54 46.98,34.07 47.63,34.52 47.63,37.31 47,37.89 v47,41
  Bottom 0.2: IC1.14 28.38,25.84 28.38,28.9 28.12,29.83 JP1.5 28.59,31.57 28.59,36.61 27.8,37.4 R11.1 | v47,41 R22.1
C3  (via drill 0.5)
  Top 0.2: JP1.4 28.95,27.72 46.14,27.72 49.7,32.13 49.7,33.67 48.91,34.97 48.91,36.4 49.55,37.04 v49.53,41.12
  Bottom 0.178: 25.4,38.1 R10.1
  Bottom 0.2: IC1.13 27.59,25.44 26.67,26.36 JP1.4 27.29,32.16 27.3,36.27 27.04,36.55 26.54,36.55 25.44,37.65 R10.1 | v49.53,41.12 49.75,42.55 49.75,42.56 50,43 R23.1
C4  (via drill 0.5)
  Top 0.2: v7.86,38.66 v7.84,41.51
  Bottom 0.2: IC1.12 26.79,25.43 24.13,29.2 24.11,31.78 25.38,32.85 JP5.8 24.75,33.61 24.75,36.22 24.47,36.54 23.8,36.54 22.8,37.54 R9.1 22.7,37.72 21.56,38.62 7.86,38.56 v7.86,38.66 | v7.84,41.51 8,43 R24.1
CC1  (via drill 0.5)  (1 unrouted)
  Top 0.2: v12.71,58.25 v12.71,53.93
  Bottom 0.2: LED1.12 13.81,57.66 13.22,58.25 v12.71,58.25 | v12.71,53.93 T5.3
CC2  (via drill 0.5)  (1 unrouted)
  Top 0.2: LED1.9 28.65,58.49 28.65,60.41 32.14,61.89 41.94,61.84 44,60 v44,53
  Bottom 0.2: v44,53 44.12,53.12 T2.C
CC3  (1 unrouted)
  Bottom 0.2: T3.C 48.22,54.22 43.9,54.22 41.91,56.74 33.39,56.75 32.28,56.34 LED1.8
CC4  (via drill 0.5)  (1 unrouted)
  Top 0.2: v4.61,52.89 v4.61,47.89 | v22.03,47.86 22,52 JP9.7 | LED1.6 31.36,43.51 31.34,45.25 v33.61,47.91
  Bottom 0.2: T8.3 v4.61,52.89 | v4.61,47.89 12.86,47.89 13.04,47.7 13.85,47.7 14.26,48.11 21.35,48.11 v22.03,47.86 v33.61,47.91 | JP8.8 21,53 JP9.7
D+
  Bottom 0.2: U$4.3 10.96,4.98 10.96,6.26 10.47,6.74 6.93,6.74 6.05,7.62 D2.2 4.42,7.9 R35.2
D-  (via drill 0.5)  (1 unrouted)
  Top 0.2: R36.2 9.59,9.25 v8.58,9.26
  Bottom 0.2: 7.66,7.98 8.05,8 D2.1 7.95,7.95 8,8 7,9 5.81,9 R34.2 | 7.66,7.98 11,8 11.62,7.38 11.62,4.92 | v8.58,9.26 7.66,7.98
GND  (via drill 0.5)
  Top 0.2: JP4.6 37.78,19.32 37.73,19.3 38.66,19.3 R33.1 | X3.3 35.35,4.96 35.35,6.44 35.44,6.44 37.11,6.43 | 37.11,6.43 C12.1 | 37.11,6.43 37.11,12.03 34.42,14.76 v33.44,14.76 31.94,14.76 31.86,14.68 31.86,12.16 32.32,12.16 32.32,11.66 32.17,11.71 32.15,11.03 IC3.5 32.3,9.8 32.29,9.46 32.29,9.34 26.61,9.34 26.41,9.13 25.23,9.13 22.54,11.82 | v19.19,27.41 16.51,29.75 16.5,31.77 16.51,34 15.84,34.7 15.04,34.7 14.61,34.7 14.61,36.32 14.51,36.41 14.49,36.41 12.43,38.59 v12.41,40.18 v12.25,49.27 v12.6,52.68 | v6.98,49.25 IC6.2@1 IC6.2 7,57 6.08,57.98 6.08,59 C13.2 | v44.33,45.83 v44.72,49.53 | C3.- 2.45,10.14 2.45,9.54 3.86,9.54 3.83,8.19 | U$4.CASING3 13.25,2.2 15.22,2.19 | 15.22,2.19 15,2 | 15.22,2.19 15.19,2.16 U$4.CASING2 6.8,3.02 3.74,6.08 3.74,8.1 3.83,8.19 | 15.22,2.19 15.24,2.17 18.36,2.17 19.73,3.15 19.73,3.56 19.75,3.56 X2.2 | 3.83,8.19 3.82,8.2 C5.2
  Top 0.406: C4.- 27.09,16.02 27.92,16.02 27.92,15.02 v27.09,14.19 | v24.2,13.91 24.18,13.91 23.12,14.41
  Top 0.61: v19.28,11.14 19.32,11.11 21.83,11.11 22.54,11.05 22.54,11.82 C1.2 22.53,13.54 22.53,14.41 23.12,14.41 v24.5,18.5
  Bottom 0.2: 36.5,21.53 34.78,21.53 34.23,21.53 33.41,20.71 32.65,20.71 32.09,20.15 IC1.21 | 36.57,21.53 36.5,21.53 | 36.5,21.53 36.5,20.45 JP4.6 | IC1.3 22.29,19.34 20.65,17.71 17.04,17.71 | 17.04,17.71 | 17.04,17.71 16.5,18.78 C7.2 17.2,19.12 17.2,23.11 16.55,23.38 C8.1 16.55,23.88 17.58,24.9 18.36,24.9 | v33.44,14.76 33.8,15.12 IC4.15 | 18.69,24.9 18.36,24.9 | 18.36,24.9 18.36,25.9 C2.2 v19.19,27.41 | v12.41,40.18 6.34,40.18 6.07,40.45 R28.2 | v6.98,49.25 8,50 8,51 T1.E | T4.E 5.86,51.04 5.86,49.97 v6.98,49.25 | v6.98,49.25 v12.25,49.27 12.27,49.28 12.81,49.64 14.19,49.65 14.7,49.01 15,49 27.69,48.99 28.02,48.71 28.11,48.7 28.05,48.7 31.59,48.7 32.05,49.1 43.1,49.11 43.61,49.61 44.74,49.61 | v12.6,52.68 JP9.8 | T3.E 47.81,50.91 47.81,49.8 47.73,49.8 45.73,49.81 45.9,49.81 45.9,50.9 44.76,50.9 T2.E | R26.2 v44.33,45.83 | v44.72,49.53 T2.E | JP8.2 33.86,56.07 33.86,56.35 35.79,56.35 35.38,56.35 37.8,56.35 42.99,51 45,51 44.91,50.91 T2.E | R32.1 21.91,1.9 C6.2 19.75,1.9 X2.2 | U$4.5 9.47,5.16 U$4.CASING4 7.34,5.16 7.34,4.42 6.85,3.57 6.54,3.43 6.54,3.41 6.58,3.5 6.6,3.57 6.49,3.57 6.49,3.54 6.05,3.57 6.05,2.15 U$4.CASING2 | D2.3 7.1,10 9.07,10.29 9,10.25 8.91,10.38
  Bottom 0.406: IC1.5 24.16,20.97 24.16,20.16 | 24.16,20.16 24.16,19.35 IC1.3 | 24.16,20.16 IC1.21 | v27.09,14.19 27.08,14.2 v24.2,13.91
  Bottom 0.61: 8.91,10.38 IC2.6 IC2.7 IC2.2 IC2.3 18.64,10.42 | 18.64,10.42 19.38,9.46 19.08,8.03 18.77,7.67 18.77,5.96 X1.2 | v19.28,11.14 19.28,11.09 19.06,10.87 19.06,10.54 18.64,10.42 | v24.5,18.5 24.16,19.35
  Bottom 1.016: X2.2 20,4.73 X1.2
  other vias: 6.72,30.19 18.43,21.91 49.96,48.5 48.4,58.25 31.08,60.64 42.45,58.48 42,54 11.2,59.21 33.22,41.03 29.22,62.38 14.44,42.42 22.28,40.91 51.3,39.09
  pour Bottom: 0,65 55,65 55,0 0,0
  pour Top: 0,65 0,0 55,0 55,65
INT0  (via drill 0.5)
  Top 0.2: R20.1 12.75,30.76 JP5.3 | v6.39,13.79 9.34,13.99 16,14 v17,15.26
  Bottom 0.2: IC1.32 24.21,16.03 21.27,16.03 20.59,15.26 v17,15.26 15.35,15.26 15.13,15.54 14.8,16.03 14.8,31.27 12.76,32.95 JP5.3 | R35.1 3.75,13.43 v6.39,13.79
INT1  (via drill 0.5)
  Top 0.2: R19.1 15.22,30.6 15.24,32.5 | 15.24,32.5 | JP5.4 15.24,32.5 | v9.45,13.24 10.09,13.24 10.39,13.54 17.47,13.55 v19.45,16.06
  Bottom 0.2: IC1.1 21.97,16.84 21.27,16.84 20.51,16.04 v19.45,16.06 15.61,16.08 15.55,16.14 15.2,16.84 15.2,30.2 15.24,30.9 JP5.4 | R34.1 v9.45,13.24
LCD_CE  (via drill 0.5)  (1 unrouted)
  Top 0.2: v29.1,40.4 28.73,41.56 28.91,45.43 29.53,45.96 | 29.53,45.96 30.24,50.21 33.89,52.68 | LED3.4 v22.13,45.88 | v29.67,45.84 29.53,45.96
  Bottom 0.2: R11.2 v29.1,40.4 | JP8.3 JP9.2 | v22.13,45.88 23.13,45.88 23.38,45.75 25.76,45.75 26.07,46.19 26.14,46.29 28.96,46.3 v29.67,45.84
LCD_D_C  (via drill 0.5)  (2 unrouted)
  Top 0.2: v26.4,40.4 28.3,41.21 28.54,46.05 30.22,51.48 31.29,52.73 31,53 | LED3.6 26.15,58.47 26.22,54.92 26,55 JP8.5 | JP9.3 30.02,54.07 v30.02,56.18
  Bottom 0.2: R10.2 v26.4,40.4 | v30.02,56.18 29.5,56.3 28.45,56.31 27.2,55.69 26.24,54.98
LCD_DIN  (via drill 0.5)  (1 unrouted)
  Top 0.2: v31.8,40.4 30.99,41.63 v30.89,49.48 | v28.51,49.45 JP9.4 | LED3.2 v17.08,49.88 | JP8.6 24.98,53.5 v24.96,49.87
  Bottom 0.2: R12.2 v31.8,40.4 | v30.89,49.48 v28.51,49.45 | v17.08,49.88 v24.96,49.87 | v24.96,49.87 28.78,49.43 | v24.96,49.87 25,49.62
LCDBKLED  (via drill 0.5)
  Top 0.2: v23.7,40.4 23.3,41.97 23.1,45.09 23.21,48.17 22.44,49.33 22.43,56.23 21.13,56.96 21.13,58.71 LED3.7
  Bottom 0.2: R9.2 v23.7,40.4
LCDCLK  (via drill 0.5)
  Top 0.2: v37.2,40.4 36.08,44.07 v35.4,50.57 | LED3.9 v15.97,56.39 v15.96,51.43
  Bottom 0.2: R14.2 v37.2,40.4 | v15.97,56.39 18.93,56.25 JP8.7 | JP9.5 25.48,51.45 | 25.48,51.45 v15.96,51.43 | 25.48,51.45 27.2,50.65 28.48,50.82 32.74,50.82 32.63,50.81 35.04,50.81 v35.4,50.57
LCDPWR  (via drill 0.5)  (1 unrouted)
  Top 0.2: C13.1 IC6.1 | JP9.6 v23.68,50.7 | v14.45,50.66 v14.44,56.73 | v9.59,58.01 8.25,57.64 8.52,55.99 | JP8.1 38.27,53.12 v38.27,49.89
  Bottom 0.2: v14.45,50.66 v23.68,50.7 25.41,50.7 27.09,50.22 31.66,50.27 32.05,49.81 38.19,49.81 v38.27,49.89 | v14.44,56.73 11.51,57.92 v9.59,58.01
LCDRST  (via drill 0.5)
  Top 0.178: 26.64,37.01 R8.2
  Top 0.2: R8.2 26.18,37.7 26.17,38.62 25.15,40.19 24.78,42.3 25,42 | LED1.3 25,42 | LED2.5 JP9.1 v36.56,51.32 | 25,42 26,43 v27.42,51.45 | v27.42,51.45 27.49,52.3 27.49,53.38 JP8.4 | v27.42,51.45 27.3,51.11
  Bottom 0.2: v36.56,51.32 v27.42,51.45
MISO
  Bottom 0.2: IC1.16 34.5,24.84 JP4.1 33.02,28.04 JP1.7 34.26,32.3 34.28,32.33 34.28,33.85 33.65,34.56 33.65,36.61 R13.1
N$1  (via drill 0.5)  (1 unrouted)
  Top 0.2: 7.6,11.95 3.69,13.83 0.86,13.83 0.87,33.83 1.61,34.33 3.75,34.33 4.44,34.8 4.45,36.48 3.83,36.95 3.83,55.08 IC6.3 | 10.03,11.46 v10.06,11.46
  Top 0.6: C5.1 7.48,11.42 C3.+ v10.06,11.46 | 7.6,11.95 8.55,11.62 v10.06,11.46
  Top 0.61: v10.06,11.46 D1.C
  Bottom 0.6: IC2.8 10.7,12.95 10.16,12.41 10.16,11.56 v10.06,11.46
N$2  (via drill 0.5)
  Top 0.2: v33.07,19.96 31.88,21.15 31.88,22.44 32.75,23.31 32.75,23.32 v33.48,24.05 | R1.1 36.19,37.23 36.21,34.84 35.62,34.08 JP2.3
  Bottom 0.2: IC1.23 31.49,18.58 32.22,18.58 33.02,19.38 33.02,19.82 33.04,19.84 33.04,19.85 33.07,19.88 v33.07,19.96 | v33.48,24.05 34.03,24.05 34.39,24.45 35.73,24.45 36.43,25.1 36.43,26.14 36.41,26.16 36.41,26.33 35.65,27.09 35.69,27.96 34.31,29.27 34.3,31.44 JP2.3
N$3
  Bottom 0.2: IC1.24 31.49,17.75 31.52,17.77 32.2,17.77 33.78,19.36 39.29,19.36 40.65,20.71 40.65,30.67 38.32,33 JP2.4 38.74,34.21 38.74,37.61 R2.1
N$4
  Bottom 0.2: IC1.25 30.83,17.12 32.17,17.12 33.99,18.9 39.57,18.9 41.12,20.49 41.12,30.86 40.7,31.28 JP2.5 40.7,34.27 41.29,34.86 41.29,37.54 R3.1
N$5  (via drill 0.5)
  Top 0.2: v8.81,53.35 v9.83,56.7 | v11.33,52.55 v10.98,46.31
  Bottom 0.2: v8.81,53.35 9.02,52.12 9.89,52.12 T1.B v11.33,52.55 | v9.83,56.7 T5.1 | v10.98,46.31 11,45 R21.2
N$6  (via drill 0.5)
  Top 0.2: v46.93,45.78 v47.19,52.88 v45,57
  Bottom 0.2: R22.2 v46.93,45.78 | v47.19,52.88 T2.B | T6.1 v45,57
N$7
  Bottom 0.2: IC1.26 29.32,16.11 29.32,15.54 29.56,15.3 30.37,15.3 31.74,16.68 32.35,16.68 34.17,18.5 40,18.5 41.6,20.34 41.6,31.53 43.07,33 JP2.6 43.24,33.82 43.81,34.39 43.81,37.46 R4.1
N$8  (via drill 0.5)
  Top 0.2: v32.77,21.53 38.42,21.53 v39.4,20.66 | C1.1 24.63,21.73 24.92,22.02 25.65,22.02 26.52,21.14 v27.64,21.14
  Bottom 0.2: 31.53,20.99 32.02,20.99 32.05,20.96 v32.77,21.53 | v39.4,20.66 40.15,21.57 40.15,22.41 39.79,22.79 39.79,26.3 39.36,26.73 JP3.1 | v27.64,21.14 28.06,20.72 30.65,20.72 30.71,20.77 30.9,20.77 31.08,20.95 IC1.20
  Bottom 0.406: IC1.20 31.53,20.99
N$9
  Bottom 0.2: R25.1 45.09,60.43 42.56,60.43 33.49,60.38 LED2.8
N$10
  Bottom 0.2: R26.1 33.87,42.61 LED2.3
N$11
  Bottom 0.2: R27.1 7.28,60.49 17.68,60.49 18.76,60.44 LED3.8
N$12  (via drill 0.5)
  Top 0.2: LED3.3 20.72,42.97 20.73,41.53 v20.01,40.88
  Bottom 0.2: v20.01,40.88 18.2,41.3 10.47,41.28 9.95,40.72 7.18,40.73 5.46,42.3 R28.1
N$13  (via drill 0.5)
  Top 0.2: v29.56,21.57 29.58,21.58 v30.25,26.6
  Bottom 0.2: IC1.19 31.38,21.66 v29.56,21.57 | v30.25,26.6 30.28,26.59 30.36,26.93 30.41,29.12 JP1.6
N$14
  Bottom 0.2: IC1.2 22.33,18.55 21.07,17.29 15.6,17.29 15.6,27.64 16.31,29.9 16.31,32.01 17.84,33.07 JP5.5 17.78,33.73 17.14,34.34 17.14,36.26 16.88,36.54 16.11,36.54 R5.1
N$15  (via drill 0.5)
  Top 0.2: v51.26,44.49 51.45,46.26 51.41,49.52 v51.3,53.53
  Bottom 0.2: T7.1 49.73,54.18 50.52,54.13 T3.B 50.55,53.51 51.28,53.51 v51.3,53.53 | R23.2 v51.26,44.49
N$16
  Bottom 0.2: T4.B 6.81,54.32 5.81,54.33 T8.1 3.83,55.49 3.83,44.89 R24.2
N$17  (via drill 0.5)
  Top 0.2: v27.62,19.2 29.12,20.7 30.23,20.86 31.34,25.56 v31.33,25.6
  Bottom 0.2: IC1.22 30.79,19.36 30.52,19.63 27.63,19.63 27.62,19.62 v27.62,19.2 | v31.33,25.6 31.35,25.57 31.72,26.95 31.77,31.52 JP2.2
N$19
  Top 0.2: R6.1 22.22,37.11 22.22,34.81 21.59,34.17 21.59,31.55 20.51,30.48 JP1.2
  Bottom 0.2: IC1.9 20.34,29.3 JP1.2
N$20
  Bottom 0.2: IC1.10 25.18,25.39 21.57,29.32 21.55,31.88 22.86,32.81 JP5.7 22.86,33.83 22.22,34.46 22.22,36.3 21.99,36.54 21.41,36.54 R7.1
N$22
  Bottom 0.61: R32.2 23.81,4.28 LED4.C
N$23  (via drill 0.5)
  Top 0.2: C9.1 38.58,16.38 v42.8,16.2
  Bottom 0.2: v42.8,16.2 42.8,16.39 IC4.1
N$24
  Top 1.27: D1.A X1.1
  Bottom 0.61: X1.1 15.9,4.8 X2.1
N$25  (via drill 0.5)
  Top 0.2: C10.1 38.53,12.59 v42.8,12.59
  Bottom 0.2: v42.8,12.59 42.83,12.58 IC4.4
N$29
  Top 0.2: R8.1 24.75,37.24 24.75,34.8 24.13,34.18 24.12,31.69 22.91,30.48 JP1.3
  Bottom 0.2: IC1.11 25.97,25.45 24.13,27.3 JP1.3
N$30
  Top 0.25: R18.1 Q1.2
  Bottom 0.2: Q1.2 IC1.8
  Bottom 0.25: Q1.2 C8.2
N$31  (via drill 0.5)
  Top 0.2: C10.2 39.18,11.34 v42.8,11.34
  Bottom 0.2: v42.8,11.34 42.73,11.31 IC4.5
N$32  (via drill 0.5)
  Top 0.2: C9.2 38.71,14.34 v42.8,14.34
  Bottom 0.2: v42.8,14.34 42.42,13.85 IC4.3
N$35
  Bottom 0.406: C11.2 24.8,12.72 28.71,8.81 28.71,3.72 29.76,2.67 36.19,2.67 37.28,3.77 38.73,5.08 38.73,15.12 IC4.2
N$36  (via drill 0.5)
  Top 0.2: R18.2 18.54,25.38 18.61,25.38 18.57,25.41 v16.87,25.41 16.82,25.4 R19.2
  Bottom 0.2: v16.87,25.41 16.5,25.99 16.5,27.08 17.65,28.63 18.36,28.63 19.05,29.39 19.04,31.77 20.2,32.88 JP5.6 20.32,33.6 19.69,34.23 19.69,36.45 19.62,36.52 18.85,36.52 R16.1
N$37  (via drill 0.5)  (2 unrouted)
  Top 0.2: R1.2 40.75,40.34 40.65,59.34 39,61 34.85,61.16 LED2.7 | LED1.11 23.17,58.97 23.17,58.98 23.17,59.78 v22.14,61.91 | v34.87,61.12 34.85,59.35 34.91,59.38
  Bottom 0.2: v22.14,61.91 22.24,62 24.43,61.99 v34.87,61.12
N$38  (via drill 0.5)
  Top 0.2: v39.9,40.4 v39.79,57.51 | v37.35,57.55 LED2.6
  Bottom 0.2: R2.2 v39.9,40.4 | LED1.7 v37.35,57.55 37.3,57.54 v39.79,57.51
N$39  (via drill 0.5)
  Top 0.2: v42.6,40.4 42.5,40.22 | LED2.4 v35.61,41.42 35.61,38.55 34.58,37.42 28.66,37.48 26.89,39.62 25.94,39.7 25.55,40.34 25.8,41.09 27.29,42.3 27.28,42.28 27,42 LED1.4
  Bottom 0.2: R3.2 v42.6,40.4 42.29,41.32 v35.61,41.42
N$40  (via drill 0.5)  (1 unrouted)
  Top 0.2: v45.3,40.4 v42.86,45.58
  Bottom 0.2: R4.2 v45.3,40.4 | v42.86,45.58 30.64,45.52 29.89,43.97 29.87,43.99 28.49,42.88 28.51,41.18 23.11,41.16 LED1.2
N$41  (via drill 0.5)  (1 unrouted)
  Top 0.2: v15.6,40.4 15.67,42.01 v15.68,42.25 15.82,45.41 v15.81,45.53 | v27.35,45.53 27.39,44.07
  Bottom 0.2: R5.2 v15.6,40.4 | v15.81,45.53 21.11,45.53 21.52,45.13 26,45.13 26.42,45.55 27.37,45.53 v27.35,45.53 | LED1.1 v15.68,42.25
N$42  (via drill 0.5)
  Top 0.178: 20.32,38.1 20.32,36.83 R6.2
  Top 0.2: 20.32,38.1 18.55,41.76 18.55,45.11 19.71,46.56 19.69,49.78 17.26,52.06 17.14,55.7 18.34,58.52 v18.34,61.22 | LED1.10 23.55,58.74 23.55,60.77 v24.02,61.12
  Bottom 0.2: LED2.9 29.9,59.31 29.83,61.12 v24.02,61.12 21.68,61.02 21.13,61.57 19.04,61.55 v18.34,61.22
N$43  (via drill 0.5)  (1 unrouted)
  Top 0.2: v20.71,60.4 20.7,56.94 19.86,56.07 19.86,52.04 20.87,50.44 20.86,44 20.9,43.91 21.13,43.32 21.13,40.64 v21,40.4 21.02,40.4 21.02,38.56 25.69,38.58 25.67,36.44 30.48,36.42 v32.15,36.7 | LED1.5 30.43,39.97 | v32.15,38.61 30.43,39.98 30.43,39.97
  Bottom 0.2: R7.2 v21,40.4 | v20.71,60.4 21.4,60.59 23.08,60.63 23.63,60.23 24.82,60.55 26.3,60.54 LED2.10 | v32.15,36.7 v32.15,38.61
N$50  (via drill 0.5)  (1 unrouted)
  Top 0.2: v34.5,40.4 33.6,44.56 v34.85,47.14 | v14.66,47.12 14.57,44.03
  Bottom 0.2: R13.2 v34.5,40.4 | v34.85,47.14 25.93,47.12 25.93,47.15 25.61,47.46 23.19,47.46 23.16,47.43 23.16,47.41 22.85,47.1 20.79,47.11 19.23,47.11 18.88,47.46 15.05,47.46 14.69,47.1 v14.66,47.12
N$52  (via drill 0.5)
  Top 0.178: 15.24,38.1 15.76,37.59 | 16.51,36.83 R15.2
  Top 0.2: R15.2 | v48,40.4 48.02,48.66 | 48.02,48.66 47.91,48.73 | 13.48,50 13.45,38.69 15.24,38.1 16.51,36.83 16,37 16,38 | 13.48,50 13.5,58.94 14.58,59.36 LED3.10 14.61,59.37 14.4,59.3 | v13.46,48.59 13.47,49.39 13.48,49.66 13.48,50 | v48.07,48.71 48.08,48.71 48.02,48.66
  Bottom 0.2: R30.2 v48,40.4 | v13.46,48.59 27.24,48.61 27.63,48.28 32.03,48.3 32.53,48.68 43.91,48.71 v48.07,48.71
N$53  (via drill 0.5)  (1 unrouted)
  Top 0.2: v18.15,40.36 18.15,46.47 | v50.7,40.4 50.42,46.71 v50.48,46.6 | v18.22,46.6 18.3,46.36 18.31,46.48 | LED3.5 v24.58,46.69
  Bottom 0.2: R16.2 v18.15,40.36 | R31.2 v50.7,40.4 | v50.48,46.6 42.53,46.62 41.87,45.98 30.63,45.91 30.16,46.72 v24.58,46.69 24,46.68 v18.22,46.6
N$68  (via drill 0.5)
  Top 0.2: C12.2 40.14,10.05 v42.8,10.05
  Bottom 0.2: v42.8,10.05 42.77,10.04 IC4.6
N$69  (via drill 0.5)
  Top 0.2: R17.2 18.45,20.55 v16.41,20.56 16.02,20.81 15.6,21.23 15.6,25.17 R20.2 | R15.1 19.42,36.46 19.43,36.46 19.69,36.31 19.69,36.08 19.69,34.99 19.05,34.33 19.04,31.52 19.05,31.52 JP1.1
  Bottom 0.2: v16.41,20.56 16,20.86 16,27.25 17.43,30.11 JP1.1
N$70  (via drill 0.5)
  Top 0.2: IC3.6 33.56,10.88 | v32.71,13.82 32.74,13.8 32.74,12.77 33.57,11.94 IC3.6 | IC3.6 33.51,10.81 33.51,9.32 33.13,8.94 28.89,8.94 26.98,7.02 X3.1
  Bottom 0.2: v32.71,13.82 33.61,13.85 IC4.14
N$71  (via drill 0.5)
  Top 0.2: v33.86,12.98 34.84,12 IC3.7 34.84,9.34 X3.2
  Bottom 0.2: IC4.13 35.54,12.72 34.63,12.72 34.36,12.98 v33.86,12.98
N$72
  Top 0.2: R17.1 18.59,18.8 Q1.1
  Bottom 0.2: IC1.7 21.16,22.48 Q1.1 18.4,18.8 C7.1
RESET  (via drill 0.5)
  Top 0.2: v28.98,18.83 28.95,18.86 29.73,19.15 34.28,19.15 JP4.5 37.12,18.53 43.09,18.54 43.08,22 42.95,22.05 R29.1 42,22
  Bottom 0.178: IC1.29 26.67,16.51 26.77,16.51
  Bottom 0.2: v28.98,18.83 26.77,17.54 26.77,16.51 26.77,16.25
RT
  Top 0.2: R33.2 41.92,17.76 41.65,17.76 42.29,17.76 37.21,17.76 36.56,18.49 35.39,18.49 34.84,17.95 IC3.2 IC3.3
RX  (via drill 0.5)
  Top 0.2: IC3.1 36.39,17.29 v37.49,16.89
  Bottom 0.2: IC1.30 25.93,16.21 25.93,14.98 | 25.93,14.98 25.83,14.88 22.25,14.88 21.42,14.05 14.6,14.05 14.56,14.09 14,14.88 14,27.9 8.05,33 JP5.1 | 31.75,14.2 34.75,17.29 34.8,17.29 37.09,17.29 v37.49,16.89 | 31.75,14.2 31.79,13.45 33.27,12.1 34.05,12.1 34.86,11.28 35.65,11.28 IC4.12 | 31.75,14.2 31.79,14.19 31.7,14.05 28.38,14.06 27.54,14.98 25.93,14.98
SCK  (via drill 0.5)
  Top 0.2: v39.4,21.94 36.48,21.94 JP4.3
  Bottom 0.2: v39.4,21.94 39.36,21.82 39.36,25.76 36.83,28.29 JP1.8 36.82,31.8 36.81,31.84 36.83,33.98 36.2,34.71 36.18,37.5 R14.1 | IC1.17 31.52,23.3 32.09,23.3 32.64,22.75 32.65,22.75 32.67,22.73 34.17,22.73 JP4.3
SCL
  Bottom 0.2: IC1.28 27.74,16.09 27.74,15.54 28.82,14.47 30.65,14.47 32.02,15.84 32.68,15.84 34.57,17.7 40.5,17.7 42.65,20.27 42.65,30.63 43.12,31.22 46.44,31.22 48.22,33 JP2.8 48.32,33.74 48.9,34.37 48.9,37.39 R31.1
SDA
  Bottom 0.2: IC1.27 28.54,16.1 28.54,15.56 29.23,14.87 30.49,14.87 31.9,16.29 32.52,16.29 34.35,18.1 40.25,18.1 42.15,20.33 42.15,30.83 42.87,31.67 44.16,31.67 45.49,33 JP2.7 45.78,33.78 46.35,34.38 46.35,37.43 R30.1
TX  (via drill 0.5)
  Top 0.2: v31.04,10.17 31.36,10.49 31.36,14.91 | 31.36,14.91 31.36,15.86 32.3,16.8 IC3.4 | v26.38,18.82 26.29,15.43 26.29,13.39 31.35,13.39 31.36,14.91
  Bottom 0.2: JP5.2 10.32,32.88 14.4,29.43 14.4,15.32 14.82,14.67 15,14.49 21.06,14.49 21.89,15.32 24.99,15.32 25,15.33 25,16.09 IC1.31 25.18,17.6 v26.38,18.82 | IC4.11 35.54,10.17 v31.04,10.17

### Text on the board
tSilk: Pwr-v.1 | "5110" | ° | Rst-v.2 | FJ5101 | FJ5101 | 3v3 | SMA420564 | Universal LED/LCD display board | ° | ° | ° | D2 | D3 | D4 | B7 D6 B0 | B3 C0 C1 | Rx | Tx | C2 C3 C4 C5 | w/xtal:0> | ADC6 | AREF | B6 | D5 | D7 | B1 | B2 | B4 | B5 | ADC7 | ° | no xtal:0 | ° | ES2D | ADM483 | github.com/dkorobkov/ | +12-24V | 0V | A/Tx | B/Rx | Gnd
bSilk: ca:0 | ca:0 | pnp | ca: | pnp | ca: | npn | cc: | npn | cc: | LCD bl> | Universal LED/LCD display board | cc:0 | github.com/dkorobkov/ | cc:0 | Mega88 | ° | ° | MAX232 | 78L05 | °